# EAGLE design Arduino-Fio_v31 (EAGLE 6.5.0)

## Sheet 1 of 2
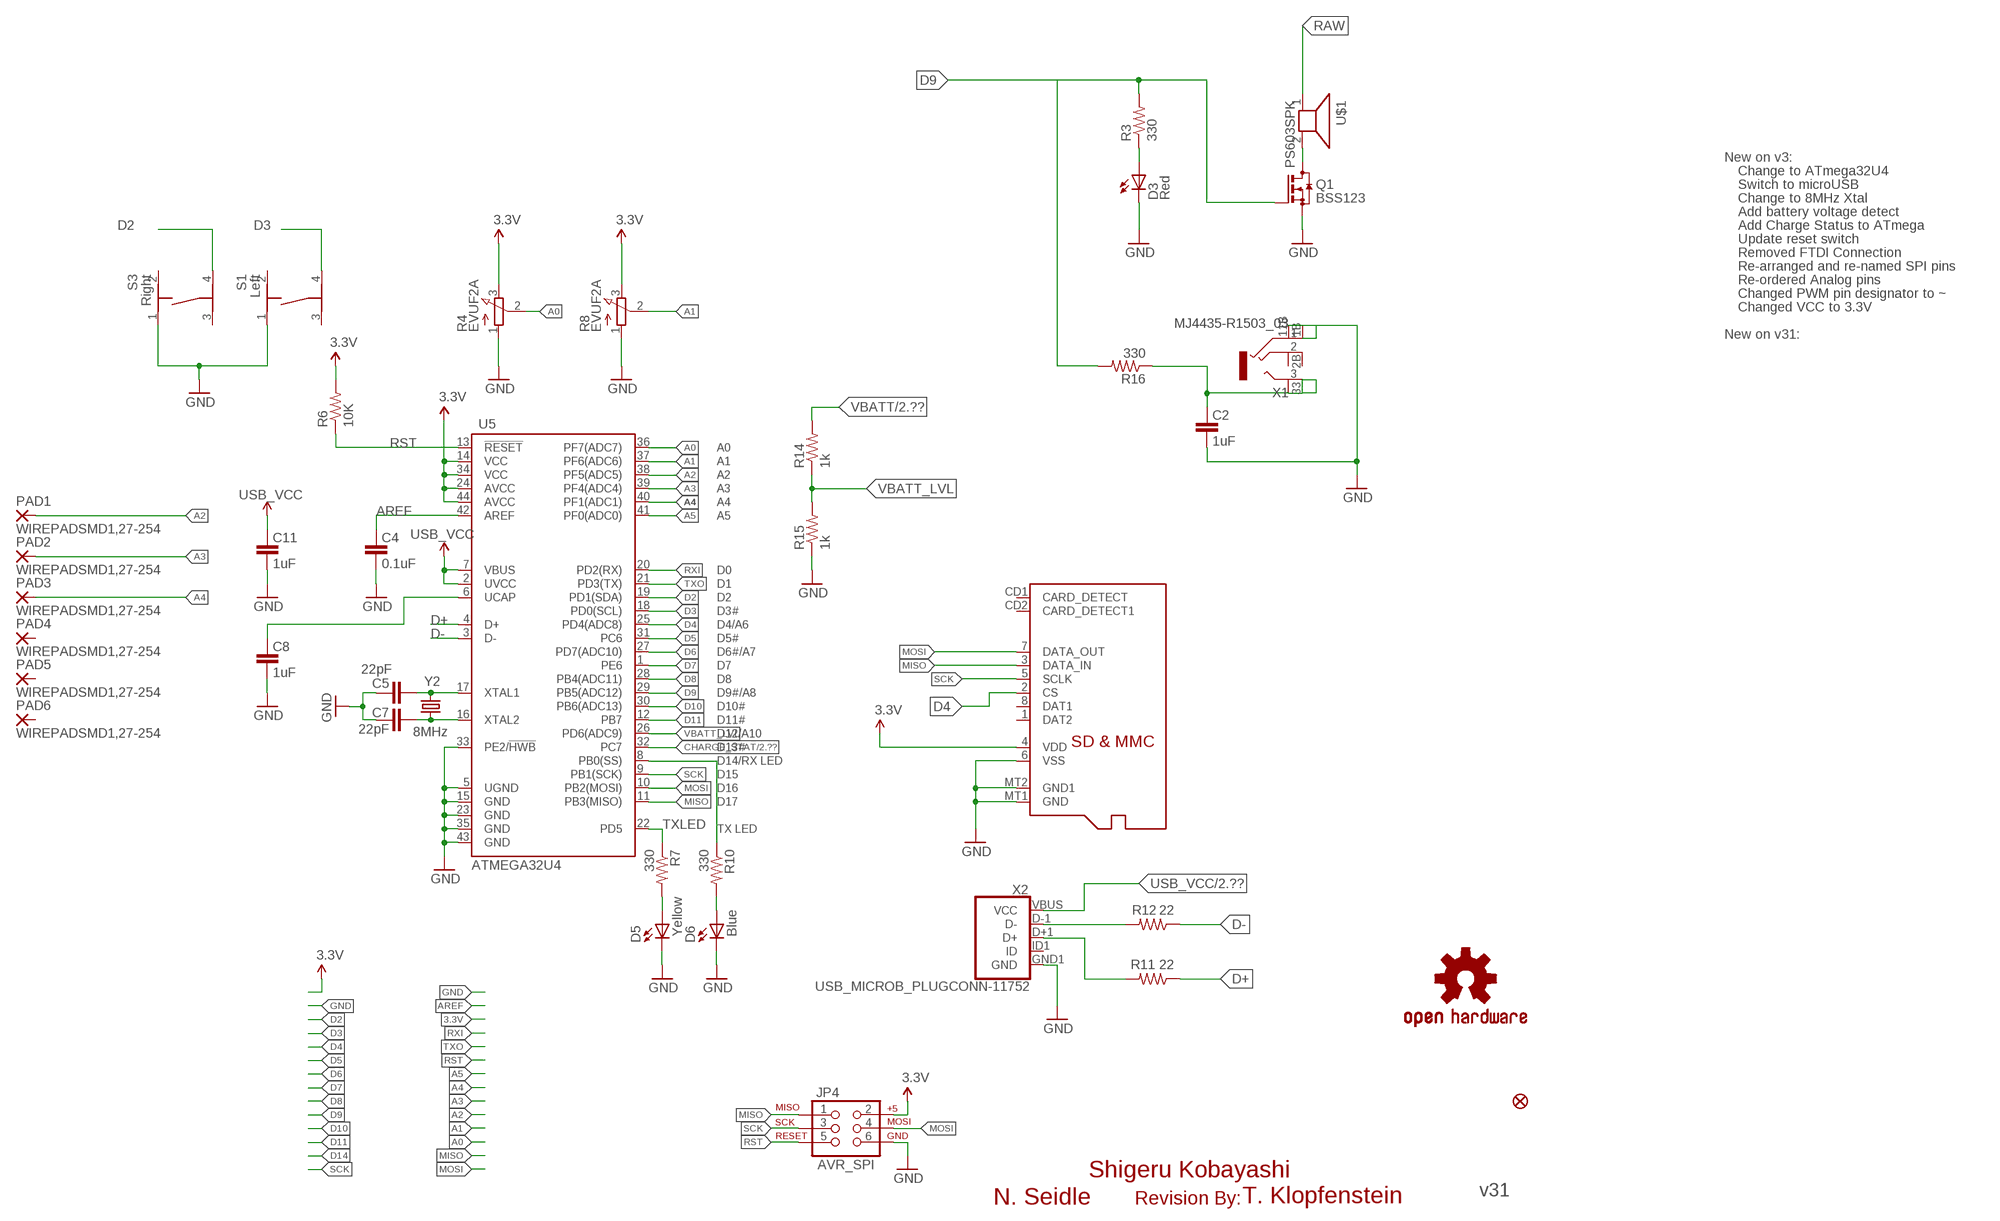
[diagram p0: schematic, sheet 1]

### Parts
C2  1uF  CAP0603-CAP  [0603-CAP]
C4  0.1uF  CAP0603-CAP  [0603-CAP]
C5  22pF  CAP0603-CAP  [0603-CAP]
C7  22pF  CAP0603-CAP  [0603-CAP]
C8  1uF  CAP0603-CAP  [0603-CAP]
C11  1uF  CAP0603-CAP  [0603-CAP]
D3  Red  LED0603  [LED-0603]
D5  Yellow  LED0603  [LED-0603]
D6  Blue  LED0603  [LED-0603]
JP4  AVR_SPI  AVR_SPI_PRG_6PTH  [2X3]
JP10  FIDUCIALUFIDUCIAL  FIDUCIAL1X2  [FIDUCIAL-1X2]
LOGO1  OSHW-LOGOL  [OSHW-LOGO-L]
PAD1  WIREPADSMD1,27-254  [SMD1,27-2,54]
PAD2  WIREPADSMD1,27-254  [SMD1,27-2,54]
PAD3  WIREPADSMD1,27-254  [SMD1,27-2,54]
PAD4  WIREPADSMD1,27-254  [SMD1,27-2,54]
PAD5  WIREPADSMD1,27-254  [SMD1,27-2,54]
PAD6  WIREPADSMD1,27-254  [SMD1,27-2,54]
Q1  BSS123  [SOT23]
R3  330  RESISTOR0603-RES  [0603-RES]
R4  EVUF2A  [EVUF]
R6  10K  RESISTOR0603-RES  [0603-RES]
R7  330  RESISTOR0603-RES  [0603-RES]
R8  EVUF2A  [EVUF]
R10  330  RESISTOR0603-RES  [0603-RES]
R11  22  RESISTOR0603-RES  [0603-RES]
R12  22  RESISTOR0603-RES  [0603-RES]
R14  1k  RESISTOR0603-RES  [0603-RES]
R15  1k  RESISTOR0603-RES  [0603-RES]
R16  330  RESISTOR0603-RES  [0603-RES]
S1  Left  TASTER-9314_SMD  [TASTER-9314_SMD]
S3  Right  TASTER-9314_SMD  [TASTER-9314_SMD]
U5  ATMEGA32U4  ATMEGA32U41:1  [QFN-44-NOPAD_1:1]
U$1  PS603SPK  [PS603]
U$2  REVISION  [REVISION]
U$3  MICROSD  [MICROSD]
X1  MJ4435-R1503_03  [1503_02]
X2  USB_MICROB_PLUGCONN-11752  [USB-B-MICRO-SMD_V03]
Y2  8MHz  CRYSTAL5X3  [CRYSTAL-SMD-5X3]

### Nets
3.3V [vcc]: JP4.2 R4.3(E) R6.2 R8.3(E) U5.14(VCC) U5.24(AVCC) U5.34(VCC) U5.44(AVCC) U$3.4(VDD) ; also sheet 2
A0: R4.2(S) U5.36(PF7(ADC7))
A1: R8.2(S) U5.37(PF6(ADC6))
A2: PAD1.1(P) U5.38(PF5(ADC5))
A3: PAD2.1(P) U5.39(PF4(ADC4))
A4: PAD3.1(P) U5.40(PF1(ADC1))
A5: U5.41(PF0(ADC0))
AREF: C4.2 U5.42(AREF)
CHARGE_STAT: U5.32(PC7) ; also sheet 2
D2: S3.4 U5.19(PD1(SDA))
D3: S1.4 U5.18(PD0(SCL))
D4: U5.25(PD4(ADC8)) U$3.2(CS)
D5: U5.31(PC6)
D6: U5.27(PD7(ADC10))
D7: U5.1(PE6)
D8: U5.28(PB4(ADC11))
D9: Q1.1(G) R3.2 R16.2 U5.29(PB5(ADC12))
D10: U5.30(PB6(ADC13))
D11: U5.12(PB7)
D14: R10.1 U5.8(PB0(SS))
D+: R11.1 U5.4(D+)
D-: R12.1 U5.3(D-)
GND: C2.1 C4.1 C5.2 C7.2 C8.1 C11.1 D3.C D5.C D6.C JP4.6 Q1.2(S) R4.1(A) R8.1(A) R15.1 S1.1 S3.1 U5.5(UGND) U5.15(GND) U5.23(GND) U5.33(PE2/!HWB) U5.35(GND) U5.43(GND) U$3.6(VSS) U$3.MT1(GND) U$3.MT2(GND1) X1.1(1_1) X1.1B(1_3) X1.11B(1_4) X2.GND1(GND) ; also sheet 2
MISO: JP4.1 U5.11(PB3(MISO)) U$3.3(DATA_IN)
MOSI: JP4.4 U5.10(PB2(MOSI)) U$3.7(DATA_OUT)
N$5: R11.2 X2.D+1(D+)
N$6: D3.A R3.1
N$13: Q1.3(D) U$1.2
N$15: D5.A R7.2
N$16: C7.1 U5.16(XTAL2) Y2.1
N$17: C5.1 U5.17(XTAL1) Y2.3
N$19: D6.A R10.2
N$20: R12.2 X2.D-1(D-)
N$21: C2.2 R16.1 X1.3(3_1) X1.33(3_3) X1.33B(3_4)
RAW [vcc]: U$1.1 ; also sheet 2
RST: JP4.5 R6.1 U5.13(!RESET)
RXI: U5.20(PD2(RX))
SCK: JP4.3 U5.9(PB1(SCK)) U$3.5(SCLK)
TXLED: R7.1 U5.22(PD5)
TXO: U5.21(PD3(TX))
UCAP: C8.2 U5.6(UCAP)
USB_VCC: C11.2 U5.2(UVCC) U5.7(VBUS) X2.VBUS(VCC) ; also sheet 2
VBATT: R14.2 ; also sheet 2
VBATT_LVL: R14.1 R15.2 U5.26(PD6(ADC9))
Unconnected: PAD4.1(P) PAD5.1(P) PAD6.1(P) S1.2 S1.3 S3.2 S3.3 U$3.1(DAT2) U$3.8(DAT1) U$3.CD1(CARD_DETECT) U$3.CD2(CARD_DETECT1) X1.2(2_1) X1.2B(2_3) X1.3B(3_2) X1.11(1_2) X1.22(2_2) X1.22B(2_4) X2.ID1(ID)

### Notes on the sheet
- New on v3:
- Change to ATmega32U4
- Switch to microUSB
- Change to 8MHz Xtal
- Add battery voltage detect
- Add Charge Status to ATmega
- Update reset switch
- Removed FTDI Connection
- Re-arranged and re-named SPI pins
- Re-ordered Analog pins
- Changed PWM pin designator to ~
- Changed VCC to 3.3V
- New on v31:
- Shigeru Kobayashi
- v31
- N. Seidle | T. Klopfenstein

## Sheet 2 of 2
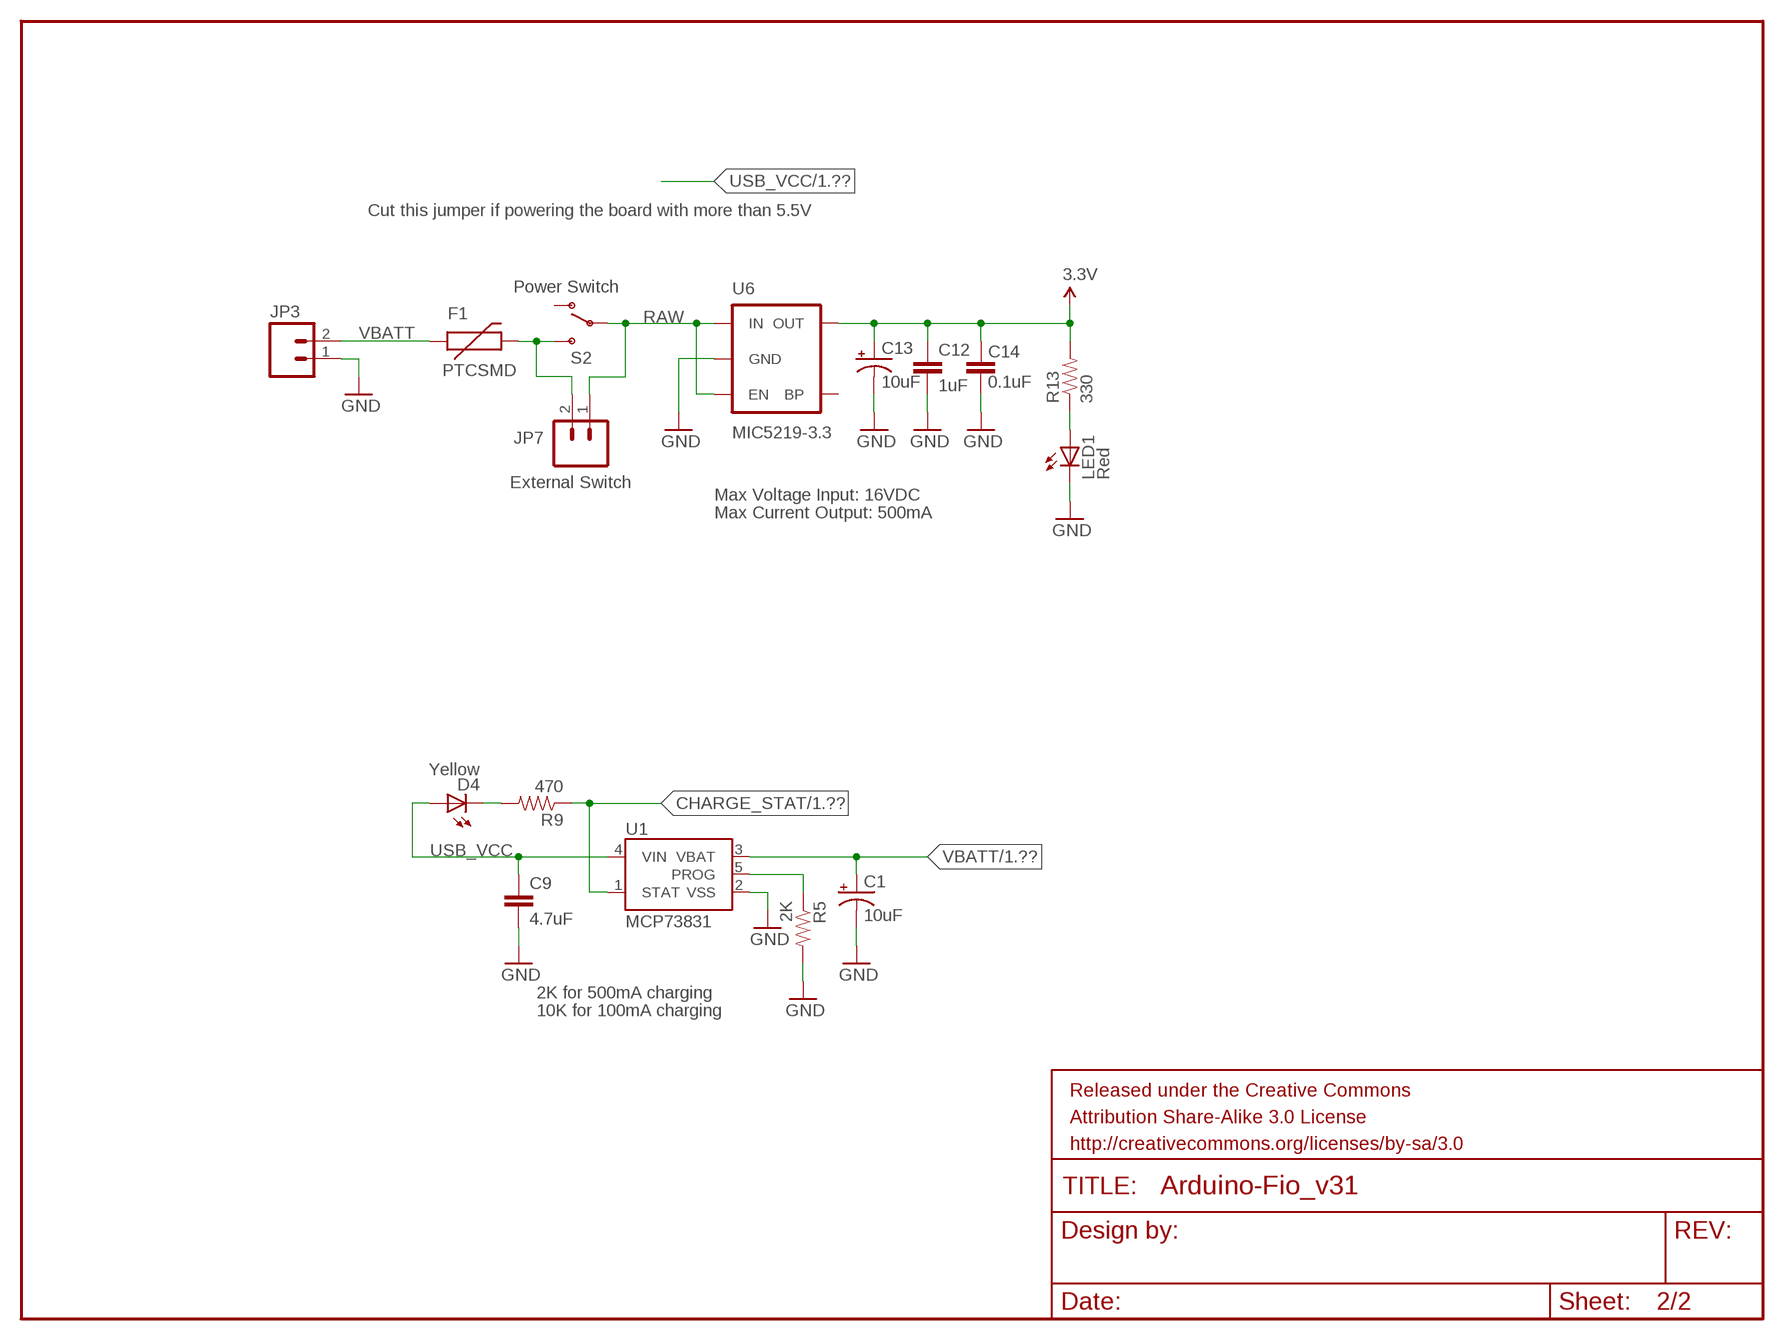
[diagram p1: schematic, sheet 2]

### Parts
C1  10uF  CAP_POL1206  [EIA3216]
C9  4.7uF  CAP0603-CAP  [0603-CAP]
C12  1uF  CAP0603-CAP  [0603-CAP]
C13  10uF  CAP_POL1206  [EIA3216]
C14  0.1uF  CAP0603-CAP  [0603-CAP]
D4  Yellow  LED0603  [LED-0603]
F1  PTCSMD  [PTC-1206]
FRAME2  FRAME-LETTER  [CREATIVE_COMMONS]
JP3  M02-JST-2MM-SMT  [JST-2-SMD]
JP7  External Switch  M02PTH  [1X02]
LED1  Red  LED0603  [LED-0603]
R5  2K  RESISTOR0603-RES  [0603-RES]
R9  470  RESISTOR0603-RES  [0603-RES]
R13  330  RESISTOR0603-RES  [0603-RES]
S2  Power Switch  SWITCH-SPSTSMD  [AYZ0202]
U1  MCP73831  [SOT23-5]
U6  MIC5219-3.3  V_REG_LDOSMD  [SOT23-5]

### Nets
3.3V [vcc]: C12.1 C13.A(+) C14.2 R13.2 U6.5(OUT) ; also sheet 1
CHARGE_STAT: R9.1 U1.1(STAT) ; also sheet 1
GND: C1.C(-) C9.2 C12.2 C13.C(-) C14.1 JP3.1 LED1.C R5.2 U1.2(VSS) U6.2(GND) ; also sheet 1
N$8: D4.C R9.2
N$9: F1.2 JP7.2 S2.3(S)
N$11: R5.1 U1.5(PROG)
N$38: LED1.A R13.1
RAW [vcc]: JP7.1 S2.2(P) U6.1(IN) U6.3(EN) ; also sheet 1
USB_VCC: C9.1 D4.A U1.4(VIN) ; also sheet 1
VBATT: C1.A(+) F1.1 JP3.2 U1.3(VBAT) ; also sheet 1
Unconnected: S2.1(O) U6.4(BP)

### Notes on the sheet
- Cut this jumper if powering the board with more than 5.5V
- Max Voltage Input: 16VDC
- Max Current Output: 500mA
- 2K for 500mA charging
- 10K for 100mA charging

## Library data of the parts
C1 C13 = SparkFun:CAP_POL: Capacitor Polarized These are standard SMD and PTH capacitors. Normally 10uF, 47uF, and 100uF in electrolytic and tantalum varieties. Always verify the external diameter of the through hole cap, it varies with capacity, voltage, and manufacturer. The EIA devices should be standard.
C2 C4 C5 C7-C9 C11 C12 C14 = SparkFun-Capacitors:CAP: Capacitor Standard 0603 ceramic capacitor, and 0.1" leaded capacitor.
D3-D6 LED1 = SparkFun:LED: LEDs Standard schematic elements and footprints for 5mm, 3mm, 1206, and 0603 sized LEDs. 5mm - Spark Fun Electronics SKU : COM-00529 (and others)
F1 = SparkFun:PTC: Resettable Fuse PTC Resettable Fuse. Spark Fun Electronics SKU : COM-08357
FRAME2 = SparkFun-Aesthetics:FRAME-LETTER: Schematic Frame Standard 8.5x11 US Letter frame
JP3 JP7 = SparkFun:M02: Header 2 Standard 2-pin 0.1" header. Use with straight break away headers (SKU : PRT-00116), right angle break away headers (PRT-00553), swiss pins (PRT-00743), machine pins (PRT-00117), and female headers (PRT-00115). Molex polarized connector foot print use with SKU : PRT-08233 with associated crimp pins and housings.
JP4 = SparkFun:AVR_SPI_PRG_6: AVR ISP 6 Pin This is the reduced ISP connector for AVR programming. Common on Arduino. This footprint will take up less PCB space and can be used with a 10-pin to 6-pin adapter such as SKU: BOB-08508
JP10 = SparkFun:FIDUCIAL: Fiducial Alignment Points Various fiducial points for machine vision alignment.
LOGO1 = SparkFun-Aesthetics:OSHW-LOGO: Open Source Hardware Logo This logo indicates the piece of hardware it is found on incorporates a OSHW license and/or adheres to the definition of open source hardware found here: http://freedomdefined.org/OSHW
PAD1-PAD6 = wirepad:WIREPAD: Wire PAD connect wire on PCB
Q1 = transistor-small-signal:BSS123: N-CHANNEL MOS FET
R3 R5-R7 R9-R16 = SparkFun-Resistors:RESISTOR: Resistor Basic schematic elements and footprints for 0603, 1206, and PTH resistors.
R4 R8 = Gaudi:EVU: 9 mm Square Rotary Potentiometers Source: Panasonic
S1 S3 = Gaudi:TASTER-9314_SMD
S2 = SparkFun:SWITCH-SPST: SPST Switch Simple slide switch. Spark Fun Electronics SKU : COM-00102
U1 = SparkFun:MCP73831: Microchip's MCP73831 Miniature single cell, fully integrated Li-Ion, Li-polymer charge management controller http://ww1.microchip.com/downloads/en/DeviceDoc/21984a.pdf
U5 = Testing:ATMEGA32U4: Atmel 44-pin 8-bit Microcontroller with 32KBytes of ISP Flash and USB Controller
U6 = SparkFun:V_REG_LDO: Voltage Regulator LDO Standard 150mA LDO voltage regulator in SOT-23 layout. Micrel part MIC5205. BP (by-pass) pin is used to lower output noise with 470pF cap.
U$1 = adafruit:PS603: PS603 Small 8 ohm speaker, from Mouser. Can SMT solder to board http://www.ladyada.net/library/pcb/eaglelibrary.html
U$2 = SparkFun-Aesthetics:REVISION
U$3 = adafruit:MICROSD: Micro-SD / Transflash card holder with SPI pinout For the 3M # 2908-05WB-MG and/or 4UCON #19656 push-push type
X1 = Gaudi:MJ4435-R: Jack connectors according to JISC 6560, 3.5 mm Klinkeneinbaukupplung nach JISC 6560, 3,5 mm, 3-polig/stereo, abgewinkelte Ausführung, Surface-Mount-Technik (SMT) Source: http://www.lumberg.com/Produkte/PDFs/1503_02.pdf
X2 = SparkFun-Connectors:USB_MICROB_PLUG: USB Micro-B Plug Comes in a variety of packages. Check out Hirose's ZX-x0 line: http://www.hirose.co.jp/cataloge_hp/e24200011.pdf; PROD_ID: CONN-11752
Y2 = SparkFun:CRYSTAL: Crystals Various standard crystals. Proven footprints. Spark Fun Electronics SKU : COM-00534

## Net classes
0 Default: width 0.203 mm
2 LEDPower: width 0.203 mm
3 ButtonSignal: width 0.203 mm

## Board
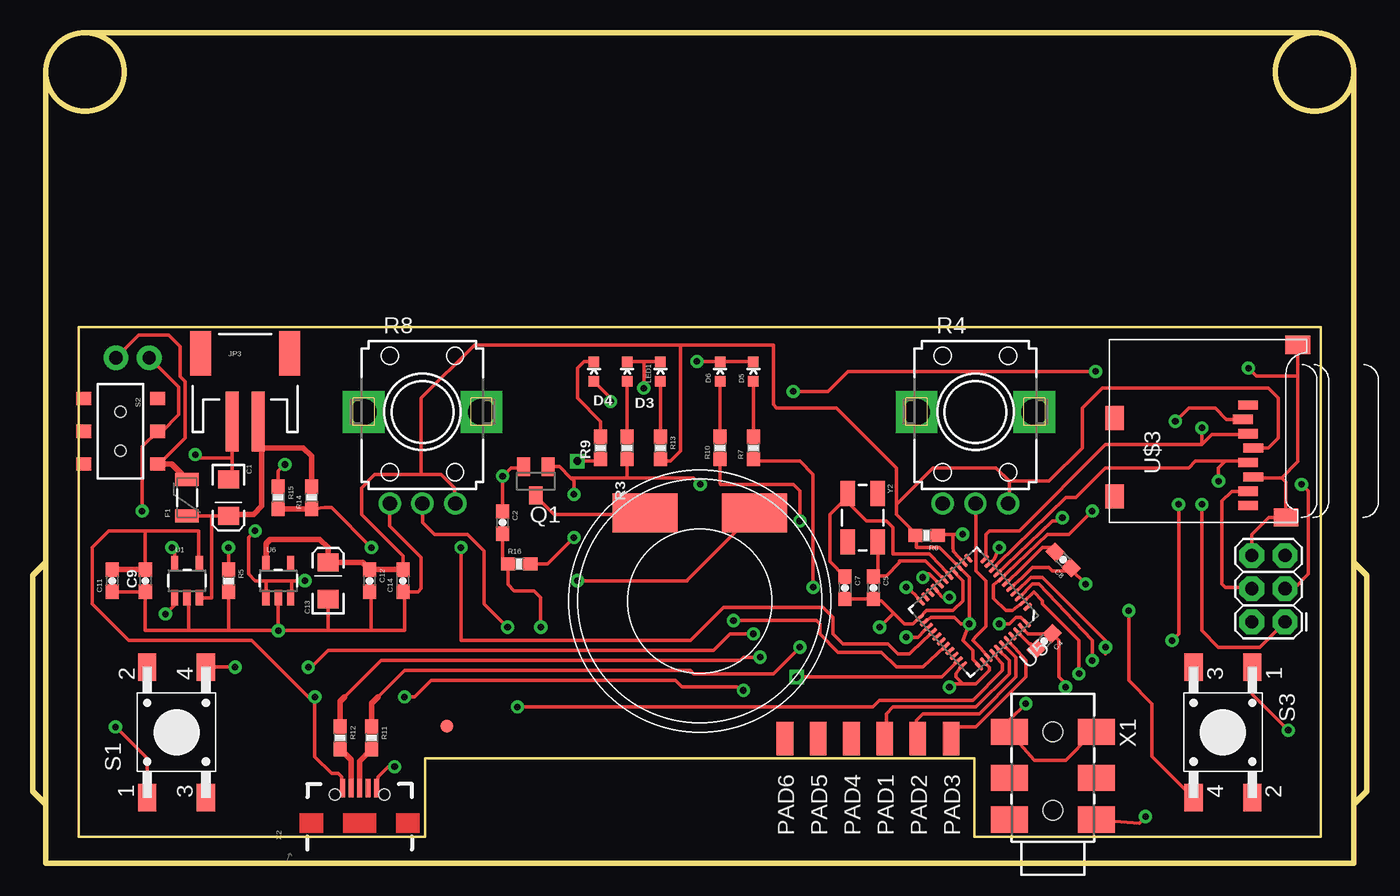
[diagram p2: board, top side]
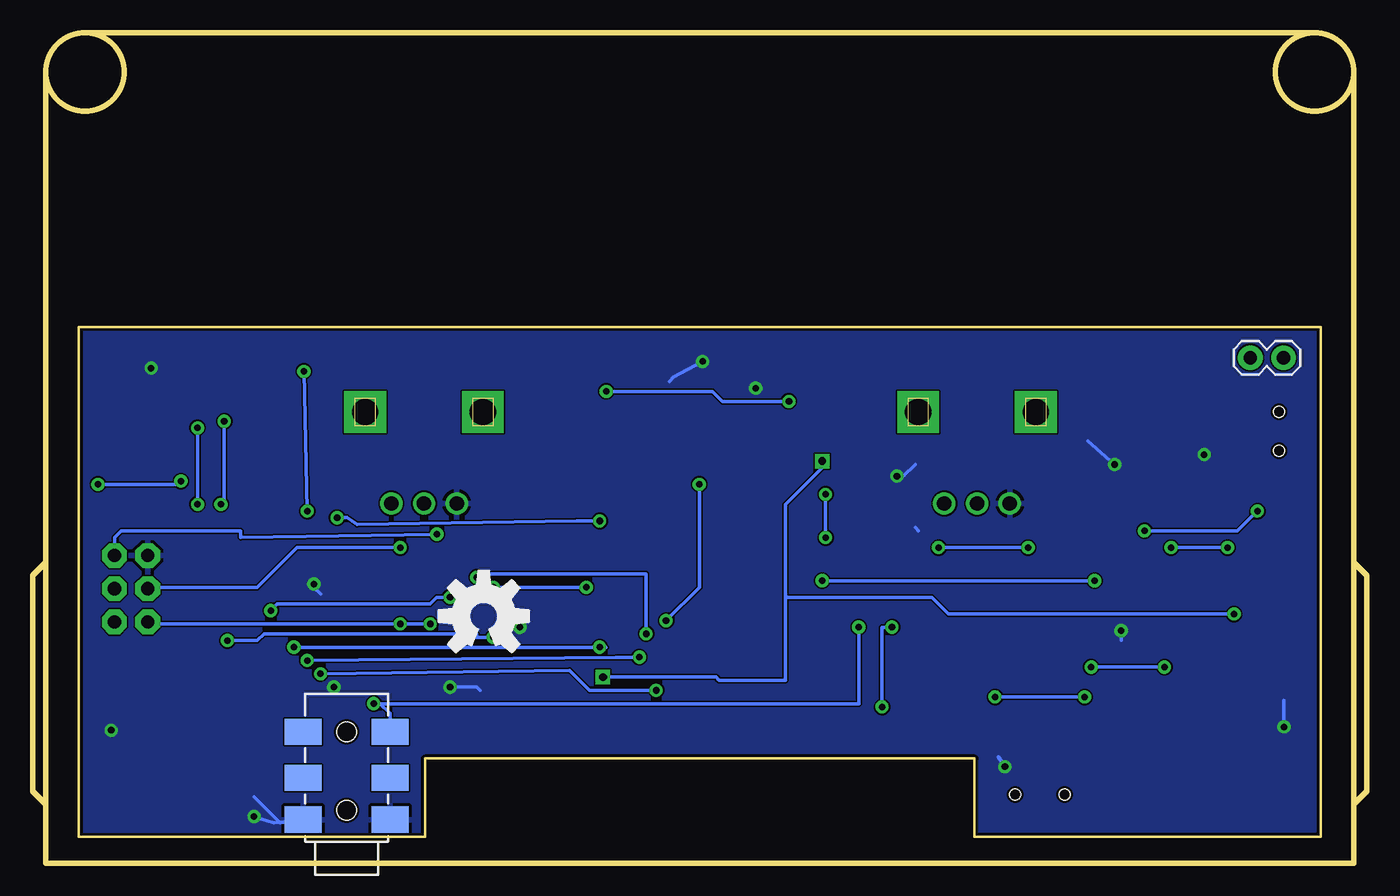
[diagram p3: board, bottom side, seen from below]

Size 102 x 63.5 mm. Coordinates in mm from the lower left corner, seen from the top.
Outline: 1,4.5 1,0 101,0 101,60.5
Outline: 1,4.5 1,23
Outline: 1,23 1,60.5
Outline: 4,63.5 98,63.5
Outline: 1,4.5 0,5.5 0,22 1,23
Outline: 101,23 102,22 102,5.5 101,4.5
Outline: 30,8 72,8 72,2 98.5,2 98.5,41 3.5,41 3.5,2 30,2 30,8
Outline: circle at 4,60.5 radius 3
Outline: circle at 98,60.5 radius 3
Copper layers (1*16): Top 0.035mm / dielectric 1.5mm / Bottom 0.035mm
Design rules "SparkFun *": minimum track width 7mil, minimum drill 15mil, track to track 5mil, track to pad 5mil, pad to pad 5mil, via to via 5mil, smd to smd 5mil, copper to edge 8mil, drill to drill 8mil, minimum pad ring 12mil, minimum via ring 10mil, stop-mask expansion 4mil, vias tented up to drill 20mil, thermal gap 10mil
tKeepout: area 11,43 to 91,61

### Footprints (pad centres in the part's own frame; a part is rotated, then mirrored left to right if it is on the bottom)
EIA3216 = smd 1.4 x 1.6: A 1.4,0; C -1.4,0
0603-CAP = smd 1.1 x 1: 1 -0.85,0; 2 0.85,0
LED-0603 = smd 0.8 x 0.8: A 0,-0.75; C 0,0.75
PTC-1206 = smd 1 x 1.8: 1 -1.4,0; 2 1.4,0
JST-2-SMD = smd 1 x 4.6: 1 -1,-3.7; 2 1,-3.7 | smd 1.6 x 3.4: NC1 -3.4,1.5; NC2 3.4,1.5
2X3 = drill 1.016 pad 1.88 octagon: 1 0,0; 2 0,2.54; 3 2.54,0; 4 2.54,2.54; 5 5.08,0; 6 5.08,2.54
1X02 = drill 1.016 pad 1.88: 1 0,0; 2 2.54,0
FIDUCIAL-1X2 = smd 1 x 1: 1 0,0
SMD1,27-2,54 = smd 1.27 x 2.54: 1 0,0
SOT23 = smd 1 x 1.4: 1 -0.95,-1.1; 2 0.95,-1.1; 3 0,1.1
0603-RES = smd 1.1 x 1: 1 -0.85,0; 2 0.85,0
EVUF = drill 1.1 pad 1.676: 1 -2.5,-7; 2 0,-7; 3 2.5,-7 | drill 2 pad 3.2 square: M1 4.5,0; M2 -4.5,0
TASTER-9314_SMD = smd 2.1 x 1.4: 1 -5,2.25; 2 5,2.25; 3 -5,-2.25; 4 5,-2.25
AYZ0202 = smd 1 x 1.15: 1 -2.5,2.825; 2 0,2.825; 3 2.5,2.825; 4 -2.5,-2.825; 5 0,-2.825; 6 2.5,-2.825 | hole 0.85: 1.5,0; -1.5,0
SOT23-5 = smd 0.55 x 1.2: 1 -0.95,-1.3; 2 0,-1.3; 3 0.95,-1.3; 4 0.95,1.3; 5 -0.95,1.3
QFN-44-NOPAD_1:1 = smd 0.8 x 0.3: 1 -3.337,2.458; 2 -3.337,1.958; 3 -3.337,1.479; 4 -3.337,0.979; 5 -3.337,0.5; 6 -3.337,0; 7 -3.337,-0.5; 8 -3.337,-0.979; 9 -3.337,-1.479; 10 -3.337,-1.958; 11 -3.337,-2.458; 23 3.337,-2.458; 24 3.337,-1.958; 25 3.337,-1.479; 26 3.337,-0.979; 27 3.337,-0.5; 28 3.337,0; 29 3.337,0.5; 30 3.337,0.979; 31 3.337,1.479; 32 3.337,1.958; 33 3.337,2.458 | smd 0.3 x 0.8: 12 -2.458,-3.337; 13 -1.958,-3.337; 14 -1.479,-3.337; 15 -0.979,-3.337; 16 -0.5,-3.337; 17 0,-3.337; 18 0.5,-3.337; 19 0.979,-3.337; 20 1.479,-3.337; 21 1.958,-3.337; 22 2.458,-3.337; 34 2.458,3.337; 35 1.958,3.337; 36 1.479,3.337; 37 0.979,3.337; 38 0.5,3.337; 39 0,3.337; 40 -0.5,3.337; 41 -0.979,3.337; 42 -1.479,3.337; 43 -1.958,3.337; 44 -2.458,3.337
PS603 = smd 5 x 3: 1 -4.184,-6.738; 2 4.184,-6.738
MICROSD = smd 0.7 x 1.5: 1 9,-10.64; 2 7.9,-10.24; 3 6.8,-10.64; 4 5.7,-11.04; 5 4.6,-10.64; 6 3.5,-11.04; 7 2.4,-10.64; 8 1.3,-10.64 | smd 1.8 x 1.4: CD1 2,-0.44; CD2 8,-0.44 | smd 1.4 x 1.9: MT1 0.4,-13.54; MT2 13.6,-14.44
1503_02 = smd 2.85 x 2: 1 -3.325,-1.8; 2 -3.325,-5; 3 -3.325,-8.5; 11 3.325,-1.8; 22 3.325,-5; 33 3.325,-8.5 | smd 2.85 x 2 bottom: 1B -3.325,-1.8; 2B -3.325,-5; 3B -3.325,-8.5; 11B 3.325,-1.8; 22B 3.325,-5; 33B 3.325,-8.5 | hole 1.5: 0,-8.5; 0,-2.5
USB-B-MICRO-SMD_V03 = smd 1.4 x 0.4: D+1 2.7,0; D-1 2.7,0.65; GND1 2.7,-1.3; ID1 2.7,-0.65; VBUS 2.7,1.3 | hole 0.85: 2.2,1.9; 2.2,-1.9
CRYSTAL-SMD-5X3 = smd 1.9 x 1.1: 1 -1.85,-1.15; 2 1.85,-1.15; 3 1.85,1.15; 4 -1.85,1.15

### Placement (x,y rotation side)
C1  14.97,27.94 270 top
C2  35.92,26.04 270 top
C4  77.33,16.95 225 top
C5  64.27,21.05 270 top
C7  62.11,21.05 270 top
C8  78.78,23.18 135 top
C9  8.62,21.59 270 top
C11  6.08,21.59 90 top
C12  25.77,21.59 270 top
C13  22.59,21.59 90 top
C14  28.3,21.59 90 top
D3  45.45,37.59 0 top
D4  42.91,37.59 0 top
D5  55.1,37.59 0 top
D6  52.56,37.59 0 top
F1  11.79,27.94 90 top
FRAME2  29.57,-29.21 0 top  (outside the outline)
JP3  16.24,37.47 0 top
JP4  95.75,18.44 90 top
JP7  8.91,38.65 0 bottom
JP10  31.67,10.47 0 top
LED1  47.99,37.59 0 top
LOGO1  67.52,18.88 0 bottom
PAD1  65.14,9.53 0 top
PAD2  67.67,9.53 0 top
PAD3  70.22,9.53 0 top
PAD4  62.59,9.53 0 top
PAD5  60.05,9.53 0 top
PAD6  57.52,9.53 0 top
Q1  38.47,29.21 180 top
R3  45.45,31.75 270 top
R4  72.08,34.5 0 top
R5  14.97,21.59 270 top
R6  68.34,25.06 180 top
R7  55.1,31.75 90 top
R8  29.8,34.5 0 top
R9  43.42,31.75 90 top
R10  52.56,31.75 90 top
R11  25.93,9.57 270 top
R12  23.52,9.57 270 top
R13  47.99,31.75 270 top
R14  21.32,27.94 90 top
R15  18.78,27.94 270 top
R16  37.2,22.86 0 top
S1  11,10 90 top
S2  6.71,33.02 270 top
S3  91,10 270 top
U1  11.79,21.59 0 top
U5  71.94,19.18 222 top
U6  18.78,21.59 0 top
U$1  51,20.04 180 top
U$2  64.5,-34.29 0 top  (outside the outline)
U$3  82.28,26.04 90 top
X1  78,1.52 180 top
X2  25,3.05 90 top
Y2  63.46,26.4 270 top

### Tracks (layer width: path | path; a pad name or v marks a point on that pad's centre or on a via)
3.3V  (via drill 0.5)
  Top 0.254: 71.61,18.34 v71.61,18.29 70.98,18.29 70.47,18.8 68.69,18.8 U5.24 | 71.61,18.34 71.61,21.85 U5.14 69.33,24.13 67.55,24.13 67.55,25 R6.2 67.3,24.89 67.3,25.4 66.02,26.67 66.02,27.43 | 71.61,18.34 71.1,17.02 71.87,16.26 71.87,15.57 U5.34 | 66.02,27.43 68.82,30.23 73.64,30.23 74.66,29.21 | 74.66,29.21 74.66,27.58 R4.3 | 66.02,27.43 66.02,30.23 61.45,34.8 56.88,34.8 56.63,35.05 56.63,39.62 49.51,39.62 | v73.9,18.29 74.66,18.29 75.17,18.8 75.56,18.8 U5.44 | U$3.4 94.46,31.73 95.23,32.51 95.23,35.56 94.47,36.32 81.77,36.32 80.25,34.8 80.25,31.75 77.71,29.21 74.66,29.21 | 49.51,39.62 33.77,39.62 29.7,35.56 29.7,29.72 | 49.51,39.62 49.51,31.5 48.75,30.73 48.16,30.73 R13.2 | C14.2 28.3,23.5 25.13,26.67 25.13,28.7 26.15,29.72 29.7,29.72 | 29.7,29.72 31.23,29.72 32.24,28.7 32.24,27.56 R8.3
  Top 0.406: U6.5 17.83,24.45 18.14,24.77 21.95,24.77 22.59,24.13 C13.A 25.21,22.99 C12.1 C14.2
  Bottom 0.254: v71.61,18.29 v73.9,18.29 93.06,18.29 JP4.2
A0
  Top 0.254: U5.36 72.44,16.44 71.87,17.02 72.09,17.31 72.88,18.1 72.88,21.59 72.12,22.35 72.12,27.46 R4.2
A1  (via drill 0.5)
  Top 0.254: U5.37 73.96,15.43 74.15,15.24 74.15,14.73 71.87,12.45 64.75,12.45 64.25,11.94 v37.07,11.94 | R8.2 29.8,26.06 30.72,25.15 33.26,25.15 34.53,23.88 34.53,19.81 v36.31,18.03
  Bottom 0.254: v37.07,11.94 37.07,18.03 v36.31,18.03
A2
  Top 0.254: U5.38 73.81,16.35 74.66,15.49 74.66,14.48 72.12,11.94 65.77,11.94 65.26,11.43 65.26,9.65 PAD1.1
A3
  Top 0.254: U5.39 74.72,16.2 75.17,15.75 75.17,14.22 72.37,11.43 68.06,11.43 67.55,10.92 67.55,9.65 PAD2.1
A4
  Top 0.254: U5.40 75.06,16.49 75.93,15.49 75.93,14.22 72.12,10.41 70.34,10.41 70.09,10.16 PAD3.1
AREF
  Top 0.254: U5.42 75.28,17.67 76.18,16.76 76.32,16.76 C4.2
CHARGE_STAT  (via drill 0.5, 0.6)
  Top 0.254: 70.52,15.29 U5.32 69.5,14.22 v58.4,14.22 | U1.1 10.85,19.75 v10.14,19.05 | v41.64,30.73 43.12,30.73 R9.1
  Bottom 0.254: v10.14,19.05 31.99,19.05 33.26,20.32 44.43,20.32 | v58.4,14.22 49.77,14.22 49.51,13.97 44.43,13.97 44.43,20.32 | 44.43,20.32 44.43,27.43 41.64,30.23 v41.64,30.73
D2  (via drill 0.5)
  Top 0.254: U5.19 69.49,20.41 69.58,20.32 v70.09,20.32 | v83.8,19.3 83.8,13.97 85.58,12.19 85.58,8.17 S3.4
  Bottom 0.254: v70.09,20.32 71.1,20.32 71.61,19.81 83.3,19.81 v83.8,19.3
D3  (via drill 0.5)
  Top 0.254: U5.18 69.09,21.57 68.56,22.1 68.31,22.1 v68.06,21.84 | S1.4 v15.48,14.99 | v55.1,17.53 53.32,17.53 52.05,16.26 22.59,16.26 21.32,14.99 v21.07,14.99
  Bottom 0.254: v55.1,17.53 55.1,22.1 67.8,22.1 v68.06,21.84 | v15.48,14.99 v21.07,14.99
D4  (via drill 0.5)
  Top 0.254: U5.25 68.22,17.82 67.67,17.27 v66.79,17.27 | U$3.2 91.27,33.94 90.41,34.8 88.38,34.8 v87.36,33.78 | v87.61,27.43 87.61,17.53 v87.11,17.02
  Bottom 0.254: v66.79,17.27 68.06,17.27 68.06,17.53 84.31,17.53 84.82,17.02 v87.11,17.02 | v87.36,33.78 87.36,27.69 v87.61,27.43
D9  (via drill 0.5)
  Top 0.254: U5.29 69.67,16.48 68.06,14.99 66.02,14.99 64.88,16.13 61.58,16.13 60.18,17.53 60.18,18.29 59.93,18.54 v53.58,18.54 | Q1.1 40.29,30.31 41.13,29.46 | R16.2 39.35,22.86 v41.39,24.89 | v41.39,28.19 41.39,29.21 41.13,29.46 | 41.13,29.46 45.45,29.46 | 45.45,29.46 50.53,29.46 v51.04,28.96 | 45.45,29.46 R3.2
  Bottom 0.254: v41.39,24.89 v41.39,28.19 | v51.04,28.96 51.04,21.08 v53.58,18.54
D14  (via drill 0.5)
  Top 0.254: U5.8 74.45,22.78 77.96,26.16 78.47,26.16 v78.72,26.42 | v58.66,26.16 58.66,28.45 58.15,28.96 52.69,28.96 | 52.69,28.96 52.6,28.96 | R10.1 52.56,29.08 52.69,28.96
  Bottom 0.254: v78.72,26.42 77.96,26.42 77.2,25.91 60.44,26.16 v58.66,26.16
D+  (via drill 0.5)
  Top 0.254: U5.4 75.97,21.5 76.31,21.84 77.2,21.84 82.03,17.02 v82.03,16.51 82.03,16 | v58.66,16.51 56.63,14.48 50.53,14.48 50.28,14.73 28.43,14.73 26.4,12.7
  Top 0.406: R11.1 25.93,12.22 26.4,12.7
  Bottom 0.254: v82.03,16.51 v58.66,16.51 58.15,16.51
D-  (via drill 0.5)
  Top 0.254: U5.3 75.42,20.32 76.44,21.34 76.95,21.34 81.01,17.02 v81.01,15.49 | v55.61,15.75 54.34,15.75 54.09,15.49 26.65,15.49 23.86,12.7
  Top 0.406: R12.1 23.52,12.36 23.86,12.7
  Bottom 0.254: v81.01,15.49 57.39,15.75 v55.61,15.75
GND  (via drill 0.5)
  Top 0.254: U5.43 76.08,17.51 76.18,17.53 77.91,17.53 C4.1 | U5.5 75.68,21.84 76.44,22.61 77.71,22.61 77.96,22.35 79.15,22.35 C8.1 79.38,22.46 v80.5,21.34 | U5.15 70.82,21.87 71.1,21.59 71.1,20.07 70.34,19.3 68.35,19.3 U5.23 67.78,18.78 67.29,18.29 66.66,18.29 65.8,19.14 | C4.1 | U5.33 70.86,14.87 70.6,14.48 70.6,14.22 71.1,13.72 | 71.1,13.72 72.12,13.72 73.14,14.73 73.14,14.98 U5.35 | U$3.MT2 96.72,37.24 | 96.72,37.24 96.72,30.7 95.49,29.46 | 95.49,29.46 93.39,29.46 U$3.6 | 95.49,29.46 95.82,29.13 U$3.MT1 94.49,26.43 93.2,25.15 JP4.6 | 96.72,37.24 93.55,37.24 v92.95,37.85 | S3.1 93.25,12.91 v96,10.16 | Q1.2 37.43,30.23 36.56,30.23 v35.92,29.59 C2.1 35.89,26.92 | R8.1 27.3,25.77 29.7,23.37 29.7,20.99 29.45,20.74 C14.1 28.43,20.61 28.43,17.78 25.89,17.78 | C11.1 C9.2 8.62,17.78 11.92,17.78 | R5.2 14.97,17.78 | 14.97,17.78 11.92,17.78 | 11.92,17.78 11.92,20.16 U1.2 | 14.97,17.78 v18.78,17.78 | v18.78,17.78 U6.2 | v18.78,17.78 22.59,17.78 | 22.59,17.78 C13.C | 22.59,17.78 25.89,17.78 | 25.89,17.78 25.89,20.61 C12.2 | 15.24,31 15.24,29.61 C1.C | JP3.1 15.24,31 | 15.24,31 15.22,30.99 12.68,30.99 v12.43,31.24 | R15.1 18.78,29.97 v19.29,30.48 | X2.GND1 26.4,6.6 27.16,7.37 v27.67,7.37 | 71.1,13.72 70.34,13.72 v70.09,13.46 | v85.07,3.56 84.61,3.05 X1.1 | C7.2 C5.2 64.4,20.07 64.88,20.07 65.8,19.14 | D5.C v50.78,38.35 52.55,38.35 D6.C | S1.1 8.75,8 v6.33,10.41 | v46.72,36.32 46.72,38.35 | 46.72,38.35 47.98,38.35 LED1.C | 46.72,38.35 45.46,38.35 D3.C | v78.98,13.46 78.98,13.72 78.47,14.22 78.47,17.02 C4.1 | 65.8,19.14 65.8,19.08 v64.75,18.03
  Bottom 0.254: v80.5,21.34 80.5,21.08 79.99,20.57 | v64.75,18.03 64.75,17.78 | v92.95,37.85 92.69,38.1 | v96,10.16 96.25,10.16 | v12.43,31.24 12.18,31.5 | v19.29,30.48 21.32,32.26 | v6.33,10.41 6.33,12.45 | v18.78,17.78 18.78,17.02 | v27.67,7.37 28.18,8.13 | 68.56,13.46 v70.09,13.46 68.06,13.46 67.8,13.21 | 85.07,5.08 83.06,3.07 X1.1 83.57,3.07 v85.07,3.56 | 34.27,25.4 34.53,25.65 | v35.92,29.59 35.42,29.59 34.53,30.48 | v50.78,38.35 53,37.16 53.32,36.83
  pour Bottom: 3.5,2 3.5,41 98.5,41 98.5,2 72,2 72,8 30,8 30,2
MISO  (via drill 0.5)
  Top 0.254: U5.11 72.88,23.37 72.88,25.15 73.14,25.4 75.42,25.4 82.03,32 89.39,32 | 89.39,32 90.15,32.77 92.85,32.77 U$3.3 | 89.39,32 v89.39,33.27 | v89.39,27.43 89.39,17.78 90.66,16.51 93.82,16.51 JP4.1
  Bottom 0.254: v89.39,33.27 v89.39,27.43
MOSI  (via drill 0.5)
  Top 0.254: U5.10 73.53,23.25 v73.9,24.13 | 93.06,20.83 JP4.4 93.11,21.08 91.17,21.08 90.92,21.34 90.92,27.69 91.67,28.43 U$3.7
  Bottom 0.254: JP4.4 93.11,21.08 84.82,21.08 81.77,24.13 v73.9,24.13
N$5
  Top 0.406: X2.D+1 25,7.8 R11.2
N$6
  Top 0.254: D3.A R3.1
N$8
  Top 0.254: 42.66,38.35 43.15,38.35 D4.C 42.9,38.35 42.15,38.35 41.64,37.85 41.64,35.56 43.42,33.78 R9.2
N$9
  Top 0.254: S2.3 9.68,30.52 11.67,32.51 11.67,36.83 11.29,37.21 11.29,39.5 10.4,40.39 8.11,40.39 JP7.2
  Top 0.406: S2.3 10.62,30.52 F1.2
N$11  (via drill 0.5)
  Top 0.254: U1.5 10.85,24.07 v10.65,24.13 | v14.97,24.13 R5.1
  Top 0.406: U1.5 10.85,23.18
  Bottom 0.254: v10.65,24.13 v14.97,24.13
N$13
  Top 0.254: Q1.3 38.47,28.07 39.86,26.67 46.71,26.67 U$1.2
N$15
  Top 0.254: D5.A R7.2
N$16
  Top 0.254: Y2.1 62.31,28.04 62.09,27.81 | 62.09,27.81 60.94,26.67 60.94,23.07 C7.1 | U5.16 69.45,22.74 68.56,23.62 65.77,23.62 65.77,25.65 65.26,26.16 63.74,26.16 62.09,27.81
N$17
  Top 0.254: Y2.3 64.61,22.24 C5.1 64.34,21.97 65.26,21.97 66.28,22.99 66.28,23.11 68.26,23.11 U5.17
N$19
  Top 0.254: D6.A R10.2
N$20
  Top 0.406: X2.D-1 24.35,7.89 R12.2
N$21  (via drill 0.5)
  Top 0.254: X1.3 80.87,9.77 78.98,7.87 76.57,7.87 X1.33 74.67,10.94 v75.93,12.19 | C2.2 35.92,23.28 R16.1 36.34,21.3 36.81,20.83 38.34,20.83 38.85,20.32 v38.85,18.03
  Bottom 0.254: v75.93,12.19 75.42,12.19 | 75.42,12.19 38.85,12.19 v38.85,18.03 | X1.33 74.67,11.45 75.42,12.19
N$38
  Top 0.254: LED1.A R13.1
RAW  (via drill 0.5)
  Top 0.254: U6.1 17.83,21.52 17.76,21.59 | 17.76,21.59 19.8,21.59 | 19.8,21.59 19.8,20.36 U6.3 | 17.76,21.59 17,21.59 16.49,22.1 16.49,24.89 v17,25.4 | v8.37,26.92 8.37,31.85 S2.2 9.89,33.02 11.16,34.29 11.16,36.39 JP7.1 | 19.8,21.59 v20.81,21.59 | v41.64,21.59 50.02,21.59 50.02,21.61 U$1.1 54.19,26.77 54.09,26.67
  Bottom 0.254: v17,25.4 9.89,25.4 v8.37,26.92 | v20.81,21.59 v41.64,21.59
RST  (via drill 0.5)
  Top 0.254: U5.13 70.41,23.81 70.34,24.13 70.34,25.14 | 70.34,25.14 70.34,25.15 v71.1,25.15 | 70.34,25.14 69.27,25.14 R6.1
  Bottom 0.254: v71.1,25.15 86.09,24.89 86.09,25.4 95.23,25.4 95.74,24.89 JP4.5
SCK  (via drill 0.5)
  Top 0.254: U5.9 73.81,22.9 78.98,27.94 79.74,27.94 82.03,30.23 88.38,30.23 88.88,30.73 91.17,30.73 | 91.17,30.73 92.82,30.73 U$3.5 | JP4.3 96.4,20.98 97.52,22.1 97.52,28.45 v97.01,28.96 | v90.66,29.21 90.66,30.23 91.17,30.73
  Bottom 0.254: v97.01,28.96 90.92,28.96 v90.66,29.21
TXLED  (via drill 0.5)
  Top 0.254: U5.22 67.47,20.53 v66.79,21.08 | v59.67,21.08 59.67,29.72 58.66,30.73 55.14,30.73 R7.1
  Bottom 0.254: v66.79,21.08 v59.67,21.08
UCAP
  Top 0.254: U5.6 75.25,22.18 77.2,24.13 77.83,24.13 C8.2
USB_VCC  (via drill 0.5)
  Top 0.254: v79.99,14.48 79.99,17.02 77.2,19.81 77.2,20.07 76.54,20.73 U5.2 74.91,19.3 74.41,19.3 73.45,20.25 73.45,21.27 U5.7 74.48,22.17 77.58,25.15 79.23,25.15 v81.01,26.92 | C9.1 8.62,25.4 | 8.62,25.4 12.68,25.4 12.68,22.95 U1.4 | X2.VBUS 23.61,5.33 23.61,6.6 23.35,6.86 22.84,6.86 21.57,8.13 v21.57,12.7 21.07,12.7 16.75,17.02 7.35,17.02 4.56,19.81 4.56,24.13 5.83,25.4 8.62,25.4 | v54.34,13.21 53.83,13.46 49.64,13.46 49.13,13.97 30.46,13.97 29.19,12.7 v28.43,12.7 | v81.26,37.59 62.34,37.59 60.82,36.07 v58.15,36.07 | v44.18,35.31 44.18,35.57 D4.A
  Top 0.406: C11.2 C9.1
  Bottom 0.254: v79.99,14.48 60.94,14.73 59.42,13.21 v54.34,13.21 | v28.43,12.7 v21.57,12.7 | v81.01,26.92 v81.26,37.59 | v58.15,36.07 50.02,36.07 49.26,35.31 v44.18,35.31
VBATT
  Top 0.254: 11.54,26.54 F1.1 C1.A 13.82,26.54 13.7,26.42 13.7,20.32 13.67,20.29 U1.3
  Top 0.406: 17.51,31.75 20.68,31.75 21.32,31.11 R14.2 | 17.51,31.75 17.51,27.3 16.88,26.67 15.1,26.67 C1.A | 17.51,31.75 17.51,33.49 JP3.2
VBATT_LVL  (via drill 0.5)
  Top 0.254: U5.26 68.08,17.05 67.04,16 66.15,16 65.39,16.76 61.96,16.76 61.2,17.53 61.2,18.8 60.44,19.56 52.82,19.56 50.28,17.02 32.75,17.02 v32.75,24.13 | R14.1 22.34,27.18 22.84,27.18 v25.89,24.13
  Top 0.406: R15.2 R14.1
  Bottom 0.254: v25.89,24.13 v32.75,24.13

### Text on the board
tValues: S. Kobayashi and N. Seidle | Toni Klopfenstein